# Altium schematic sheet deepshark_sensor.SchDoc
size A4
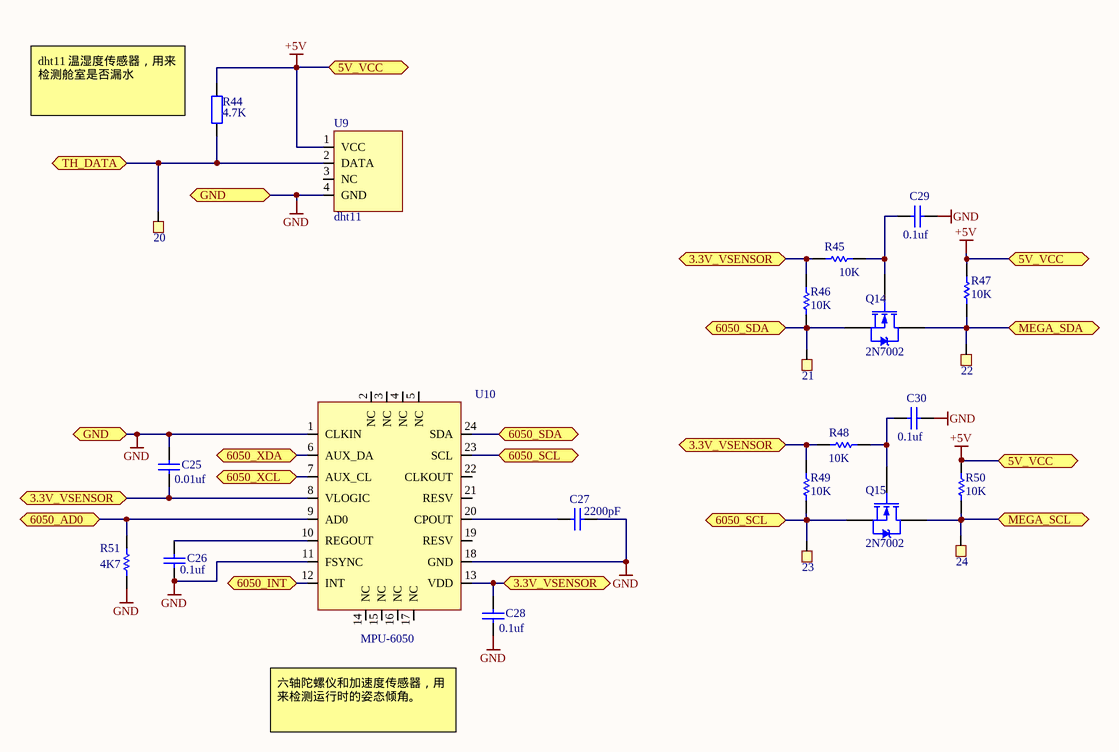
[diagram p0: deepshark_sensor.SchDoc]

## Parts
20  TP  [TestPoint]  (value not drawn)
21  TP  [TestPoint]  (value not drawn)
22  TP  [TestPoint]  (value not drawn)
23  TP  [TestPoint]  (value not drawn)
24  TP  [TestPoint]  (value not drawn)
C25  value 0.01uf  [6-0805_M]  (hidden comment: Cap)
C26  value 0.1uf  [6-0805_M]  (hidden comment: Cap)
C27  value 2200pF  [my0603]  (hidden comment: Cap)
C28  value 0.1uf  [6-0805_M]  (hidden comment: Cap)
C29  value 0.1uf  [6-0805_M]  (hidden comment: Cap)
C30  value 0.1uf  [6-0805_M]  (hidden comment: Cap)
Q14  2N7002  [2N7002]
Q15  2N7002  [2N7002]
R44  value 4.7K  [6-0805_M]  (hidden comment: Res2)
R45  value 10K  [6-0805_M]  (hidden comment: Res1)
R46  value 10K  [6-0805_M]  (hidden comment: Res1)
R47  value 10K  [6-0805_M]  (hidden comment: Res1)
R48  value 10K  [6-0805_M]  (hidden comment: Res1)
R49  value 10K  [6-0805_M]  (hidden comment: Res1)
R50  value 10K  [6-0805_M]  (hidden comment: Res1)
R51  value 4K7  [6-0805_M]  (hidden comment: Res1)
U9  dht11  [DHT11]
U10  MPU-6050  [mpu6050]

## Ports
3.3V_VSENSOR, 5V_VCC, 6050_AD0, 6050_INT, 6050_SCL, 6050_SDA, 6050_XCL, 6050_XDA, GND, MEGA_SCL, MEGA_SDA, TH_DATA

## Nets
+5V: R44.2 R47.2 R50.2 U9.1(VCC) ; port 5V_VCC
GND: C25.1 C26.1 C27.2 C28.2 C29.2 C30.2 R51.1 U9.4(GND) U10.1(CLKIN) U10.11(FSYNC) U10.18(GND) ; port GND
3.3V_VSENSOR: C25.2 C28.1 R45.1 R46.2 R48.1 R49.2 U10.8(VLOGIC) U10.13(VDD) ; port 3.3V_VSENSOR
6050_AD0: R51.2 U10.9(AD0) ; port 6050_AD0
6050_INT: U10.12(INT) ; port 6050_INT
6050_SCL: 23.1 Q15.3(S) R49.1 U10.23(SCL) ; port 6050_SCL
6050_SDA: 21.1 Q14.3(S) R46.1 U10.24(SDA) ; port 6050_SDA
6050_XCL: U10.7(AUX_CL) ; port 6050_XCL
6050_XDA: U10.6(AUX_DA) ; port 6050_XDA
MEGA_SCL: 24.1 Q15.2(D) R50.1 ; port MEGA_SCL
MEGA_SDA: 22.1 Q14.2(D) R47.1 ; port MEGA_SDA
TH_DATA: 20.1 R44.1 U9.2(DATA) ; port TH_DATA
NetC26_2: C26.2 U10.10(REGOUT)
NetC27_1: C27.1 U10.20(CPOUT)
NetC29_1: C29.1 Q14.1(G) R45.2
NetC30_1: C30.1 Q15.1(G) R48.2

Not connected (* = marked no-connect by the designer): U9 3(NC); U10 2(NC) 3(NC) 4(NC) 5(NC) 14(NC) 15(NC) 16(NC) 17(NC) 19(RESV) 21(RESV) 22(CLKOUT)

## Notes on the sheet
- (near R44) dht11 温湿度传感器，用来检测舱室是否漏水
- 六轴陀螺仪和加速度传感器，用来检测运行时的姿态倾角。

## Library data of the parts
C25-C30 = Cap: Capacitor; Published: 8-Jun-2000; LatestRevisionDate: 17-Jul-2002; LatestRevisionNote: Re-released for DXP Platform.; PackageReference: RAD-0.3; Publisher: Altium Limited; PackageDescription: Radial Cap, Thru-Hole; 2 Leads; 0.3 in Pin Spacing
Q14 Q15 = NMOS-2: N-Channel Power MOSFET; Note: Pin 2 is electrically connected to pin 4.; Published: 8-Jun-2000; LatestRevisionDate: 17-Jul-2002; LatestRevisionNote: Re-released for DXP Platform.; DatasheetVersion: PD-9.814; PackageVersion: Feb-1997; PackageReference: TO-220AB; Publisher: Altium Limited; PackageDescription: TO, Thru-Hole, Vertical, Heatsink Mounted; 3 In-Line Leads; Pitch 2.54 mm; ComponentLink1Description: Manufacturer Link; ComponentLink1URL: http://www.irf.com/
R44 = Res2: Resistor; Published: 8-Jun-2000; LatestRevisionDate: 17-Jul-2002; LatestRevisionNote: Re-released for DXP Platform.; PackageReference: AXIAL-0.4; Publisher: Altium Limited; PackageDescription: Axial Device, Thru-Hole; 2 Leads; 0.4 in Pin Spacing
R45-R51 = Res1: Resistor; Published: 8-Jun-2000; LatestRevisionDate: 17-Jul-2002; LatestRevisionNote: Re-released for DXP Platform.; PackageReference: AXIAL-0.3; Publisher: Altium Limited; PackageDescription: Axial Device, Thru-Hole; 2 Leads; 0.3 in Pin Spacing
U9 = dht411